# Altium schematic sheet cap_bank.SchDoc
size 209 x 148 mm; SheetNumber: 1; SheetTotal: 1
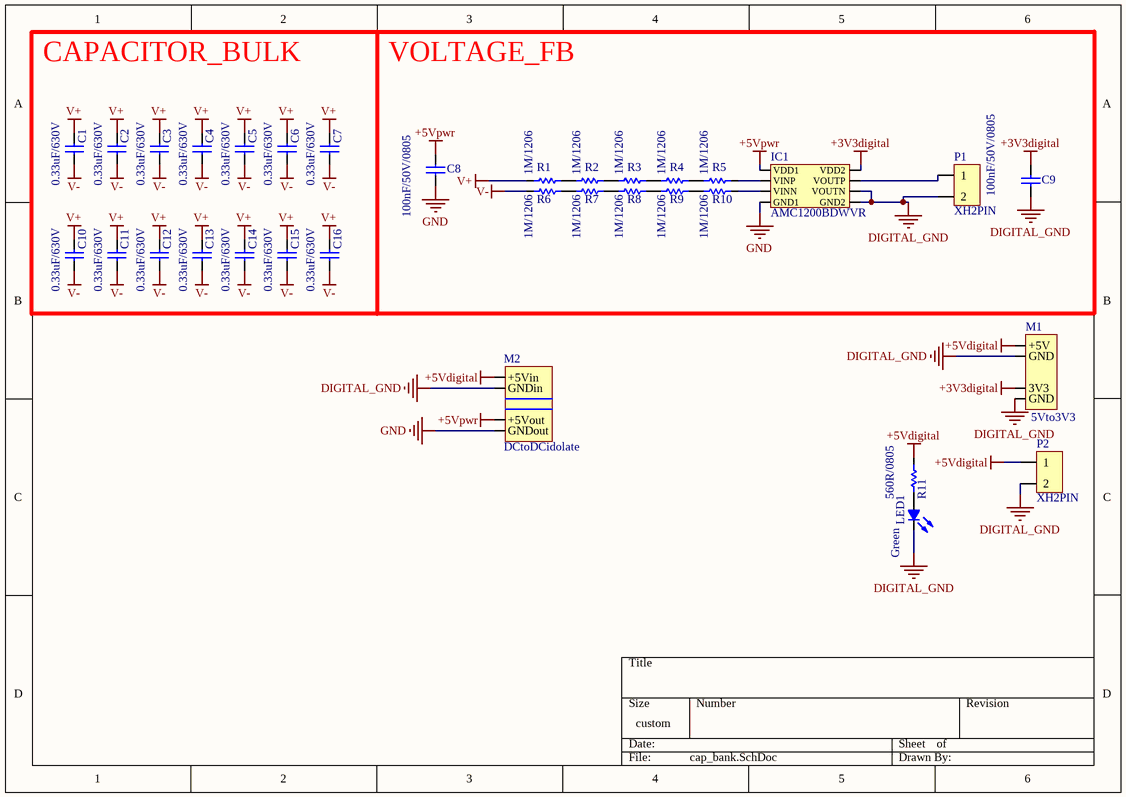
[diagram p0: cap_bank.SchDoc]

## Parts
C1  0.33uF/630V  [0.33uF/630V]
C2  0.33uF/630V  [0.33uF/630V]
C3  0.33uF/630V  [0.33uF/630V]
C4  0.33uF/630V  [0.33uF/630V]
C5  0.33uF/630V  [0.33uF/630V]
C6  0.33uF/630V  [0.33uF/630V]
C7  0.33uF/630V  [0.33uF/630V]
C8  100nF/50V/0805  [CAP 0805]
C9  100nF/50V/0805  [CAP 0805]
C10  0.33uF/630V  [0.33uF/630V]
C11  0.33uF/630V  [0.33uF/630V]
C12  0.33uF/630V  [0.33uF/630V]
C13  0.33uF/630V  [0.33uF/630V]
C14  0.33uF/630V  [0.33uF/630V]
C15  0.33uF/630V  [0.33uF/630V]
C16  0.33uF/630V  [0.33uF/630V]
IC1  AMC1200BDWVR  [SOIC8-AMC1200]
LED1  COLOR: Green  [LED 3mm]  (hidden comment: LED 3mm/Green)
M1  5Vto3V3  [5Vto3V3]
M2  DCtoDCidolate  [dctodc]
P1  XH2PIN  [XH-2Pin]
P2  XH2PIN  [XH-2Pin]
R1  1M/1206  [RES 1206]
R2  1M/1206  [RES 1206]
R3  1M/1206  [RES 1206]
R4  1M/1206  [RES 1206]
R5  1M/1206  [RES 1206]
R6  1M/1206  [RES 1206]
R7  1M/1206  [RES 1206]
R8  1M/1206  [RES 1206]
R9  1M/1206  [RES 1206]
R10  1M/1206  [RES 1206]
R11  560R/0805  [RES 0805]

## Blocks framed on the sheet
CAPACITOR_BULK: C1-C7 C10-C16

## Nets
+3V3digital: C9.1(+) IC1.8(VDD2) M1.3(3V3)
+5Vdigital: M1.1(+5V) M2.1(+5Vin) P2.1 R11.2
+5Vpwr: C8.1(+) IC1.1(VDD1) M2.3(+5Vout)
DIGITAL_GND: C9.2(-) IC1.5(GND2) IC1.6(VOUTN) LED1.2(K) M1.2(GND) M1.4(GND) M2.2(GNDin) P1.2 P2.2
GND: C8.2(-) IC1.4(GND1) M2.4(GNDout)
V+: C1.1(+) C2.1(+) C3.1(+) C4.1(+) C5.1(+) C6.1(+) C7.1(+) C10.1(+) C11.1(+) C12.1(+) C13.1(+) C14.1(+) C15.1(+) C16.1(+) R1.1
V-: C1.2(-) C2.2(-) C3.2(-) C4.2(-) C5.2(-) C6.2(-) C7.2(-) C10.2(-) C11.2(-) C12.2(-) C13.2(-) C14.2(-) C15.2(-) C16.2(-) R6.1
NetIC1_2: IC1.2(VINP) R5.2
NetIC1_3: IC1.3(VINN) R10.2
NetIC1_7: IC1.7(VOUTP) P1.1
NetLED1_1: LED1.1(A) R11.1
NetR1_2: R1.2 R2.1
NetR2_2: R2.2 R3.1
NetR3_2: R3.2 R4.1
NetR4_2: R4.2 R5.1
NetR6_2: R6.2 R7.1
NetR7_2: R7.2 R8.1
NetR8_2: R8.2 R9.1
NetR9_2: R9.2 R10.1

## Notes on the sheet
- VOLTAGE_FB

## Library data of the parts
C1-C16 = Capacitor
IC1 = AMC1200BDWVR: isolate op-amp g = 8
LED1 = LED: Typical LED
P1 P2 = Header 2H: RELAY; LatestRevisionDate: 17-Jul-2002; LatestRevisionNote: Re-released for DXP Platform.; Publisher: Altium Limited
R1-R11 = Res
  R1-R10: value: 1M/1206
  R11: value: 560R/0805